# Altium schematic sheet Connectors.SchDoc: Extension connectors
size A3; DocumentNumber: MB1137; Revision: B-01; SheetNumber: 6; SheetTotal: 6; Project: NUCLEO-XXXXZX
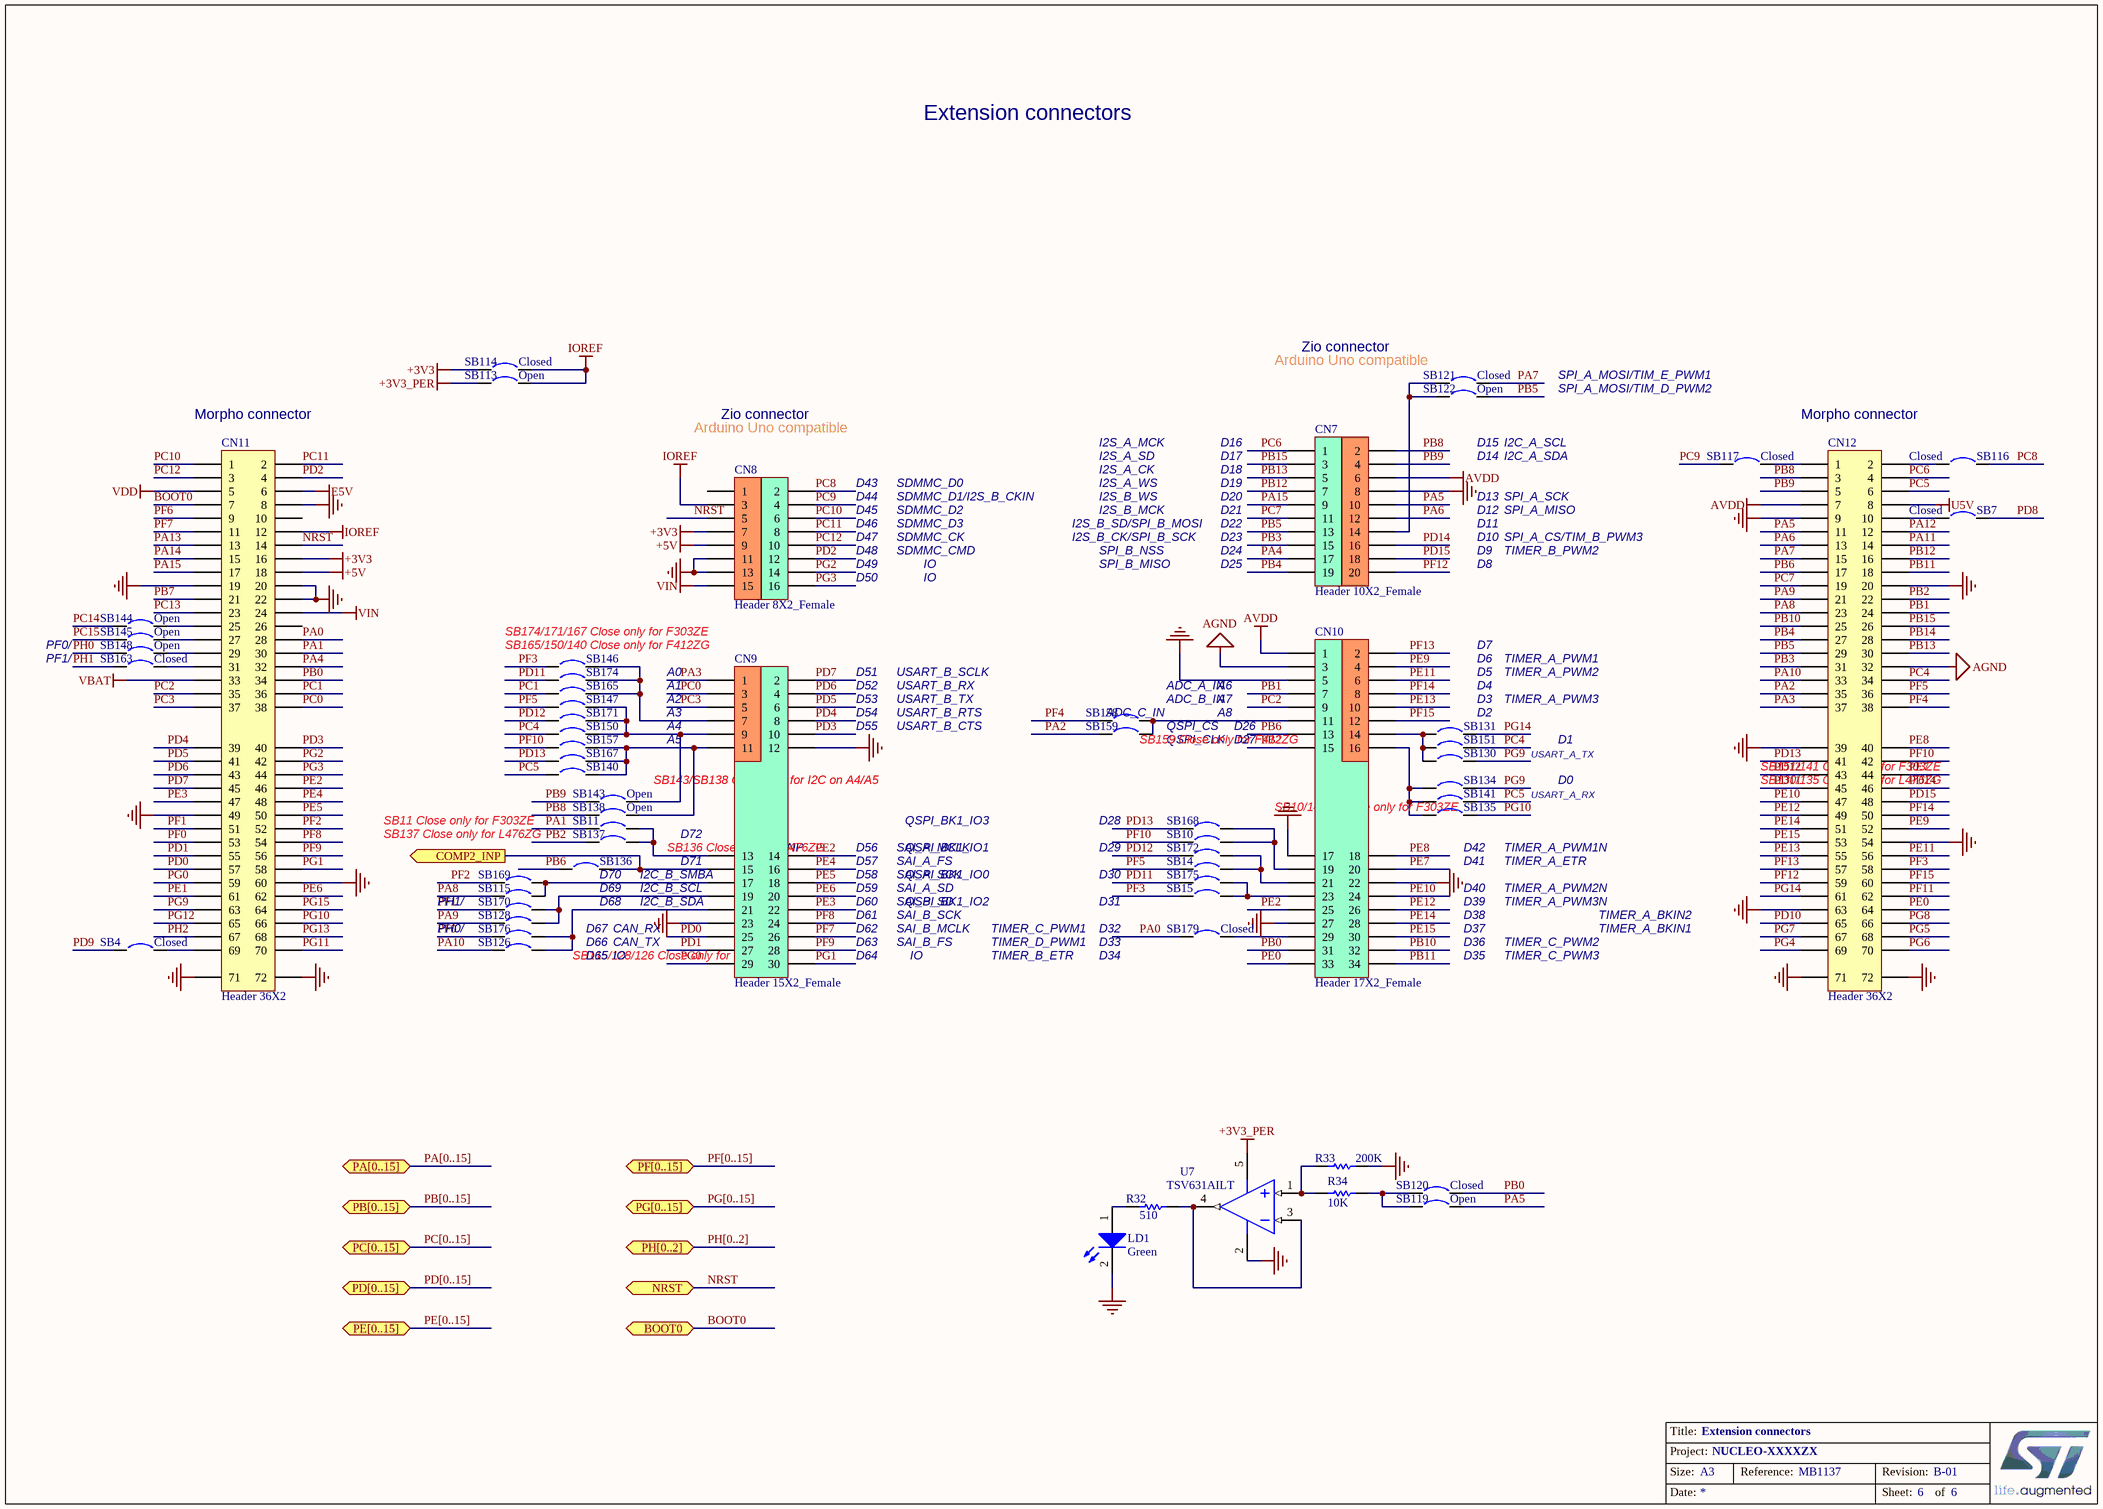
[diagram p0: Connectors.SchDoc]

## Parts
CN7  Header 10X2_Female  [HDR_10x2_2R54_V_F]
CN8  Header 8X2_Female  [HDR_8x2_2R54_V_F]
CN9  Header 15X2_Female  [HDR_15x2_2R54_V_F]
CN10  Header 17X2_Female  [HDR_17x2_2R54_V_F]
CN11  Header 36X2  [HDR_2x36_2R54_V_M]
CN12  Header 36X2  [HDR_2x36_2R54_V_M]
LD1  Green  [0603D-G]
R32  510  [0603R]
R33  200K  [0603R]
R34  10K  [0603R]
SB4  Closed  [SB_0603]
SB7  Closed  [SB_0603]
SB10  Circuit Breaker  [SB_0603]  (value not drawn)
SB11  Circuit Breaker  [SB_0603]  (value not drawn)
SB14  Circuit Breaker  [SB_0603]  (value not drawn)
SB15  Circuit Breaker  [SB_0603]  (value not drawn)
SB113  Open  [SB_0603]
SB114  Closed  [SB_0603]
SB115  Circuit Breaker  [SB_0603]  (value not drawn)
SB116  Closed  [SB_0603]
SB117  Closed  [SB_0603]
SB119  Open  [SB_0603]
SB120  Closed  [SB_0603]
SB121  Closed  [SB_0603]
SB122  Open  [SB_0603]
SB126  Circuit Breaker  [SB_0603]  (value not drawn)
SB128  Circuit Breaker  [SB_0603]  (value not drawn)
SB130  Circuit Breaker  [SB_0603]  (value not drawn)
SB131  Circuit Breaker  [SB_0603]  (value not drawn)
SB134  Circuit Breaker  [SB_0603]  (value not drawn)
SB135  Circuit Breaker  [SB_0603]  (value not drawn)
SB136  Circuit Breaker  [SB_0603]  (value not drawn)
SB137  Circuit Breaker  [SB_0603]  (value not drawn)
SB138  Open  [SB_0603]
SB140  Circuit Breaker  [SB_0603]  (value not drawn)
SB141  Circuit Breaker  [SB_0603]  (value not drawn)
SB143  Open  [SB_0603]
SB144  Open  [SB_0603]
SB145  Open  [SB_0603]
SB146  Circuit Breaker  [SB_0603]  (value not drawn)
SB147  Circuit Breaker  [SB_0603]  (value not drawn)
SB148  Open  [SB_0603]
SB150  Circuit Breaker  [SB_0603]  (value not drawn)
SB151  Circuit Breaker  [SB_0603]  (value not drawn)
SB157  Circuit Breaker  [SB_0603]  (value not drawn)
SB158  Circuit Breaker  [SB_0603]  (value not drawn)
SB159  Circuit Breaker  [SB_0603]  (value not drawn)
SB163  Closed  [SB_0603]
SB165  Circuit Breaker  [SB_0603]  (value not drawn)
SB167  Circuit Breaker  [SB_0603]  (value not drawn)
SB168  Circuit Breaker  [SB_0603]  (value not drawn)
SB169  Circuit Breaker  [SB_0603]  (value not drawn)
SB170  Circuit Breaker  [SB_0603]  (value not drawn)
SB171  Circuit Breaker  [SB_0603]  (value not drawn)
SB172  Circuit Breaker  [SB_0603]  (value not drawn)
SB174  Circuit Breaker  [SB_0603]  (value not drawn)
SB175  Circuit Breaker  [SB_0603]  (value not drawn)
SB176  Circuit Breaker  [SB_0603]  (value not drawn)
SB179  Closed  [SB_0603]
U7  TSV631AILT  [SOT-23-5L]

## Ports
BOOT0, COMP2_INP (out), NRST, PA[0..15] (bidir), PB[0..15] (bidir), PC[0..15] (bidir), PD[0..15] (bidir), PE[0..15] (bidir), PF[0..15] (bidir), PG[0..15] (bidir), PH[0..2] (bidir)

## Nets
+3V3: CN8.7 CN11.16 SB114.1
+3V3_PER: SB113.1 U7.5(VCC)
+5V: CN8.9 CN11.18
AGND: CN10.3 CN12.32
AVDD: CN7.6 CN10.1 CN12.7
E5V: CN11.6
GND: CN7.8 CN8.11 CN8.13 CN9.12 CN9.23 CN10.5 CN10.17 CN10.22 CN10.27 CN11.8 CN11.19 CN11.20 CN11.22 CN11.49 CN11.60 CN11.71 CN11.72 CN12.9 CN12.20 CN12.39 CN12.54 CN12.63 CN12.71 CN12.72 LD1.2(K) R33.2 U7.2(VDD)
IOREF: CN8.3 CN11.12 SB113.2 SB114.2
U5V: CN12.8
VBAT: CN11.33
VDD: CN11.5
VIN: CN8.15 CN11.24
BOOT0: CN11.7 ; port BOOT0
COMP2_INP: CN9.15 SB136.1 ; port COMP2_INP
NRST: CN8.5 CN11.14 ; port NRST
PA0: CN11.28 SB179.1
PA1: CN11.30 SB11.2
PA2: CN12.35 SB159.1
PA3: CN9.1 CN12.37
PA4: CN7.17 CN11.32
PA5: CN7.10 CN12.11 SB119.2
PA6: CN7.12 CN12.13
PA7: CN12.15 SB121.2
PA8: CN12.23 SB115.2
PA9: CN12.21 SB128.2
PA10: CN12.33 SB126.2
PA11: CN12.14
PA12: CN12.12
PA13: CN11.13
PA14: CN11.15
PA15: CN7.9 CN11.17
PB0: CN10.31 CN11.34 SB120.1
PB1: CN10.7 CN12.24
PB2: CN10.15 CN12.22 SB137.2
PB3: CN7.15 CN12.31
PB4: CN7.19 CN12.27
PB5: CN7.13 CN12.29 SB122.2
PB6: CN10.13 CN12.17 SB136.2
PB7: CN11.21
PB8: CN7.2 CN12.3 SB138.2
PB9: CN7.4 CN12.5 SB143.2
PB10: CN10.32 CN12.25
PB11: CN10.34 CN12.18
PB12: CN7.7 CN12.16
PB13: CN7.5 CN12.30
PB14: CN12.28
PB15: CN7.3 CN12.26
PC0: CN9.3 CN11.38
PC1: CN11.36 SB165.2
PC2: CN10.9 CN11.35
PC3: CN9.5 CN11.37
PC4: CN12.34 SB150.2 SB151.1
PC5: CN12.6 SB140.2 SB141.1
PC6: CN7.1 CN12.4
PC7: CN7.11 CN12.19
PC8: CN8.2 SB116.1
PC9: CN8.4 SB117.1
PC10: CN8.6 CN11.1
PC11: CN8.8 CN11.2
PC12: CN8.10 CN11.3
PC13: CN11.23
PC14: SB144.1
PC15: SB145.1
PD0: CN9.25 CN11.57
PD1: CN9.27 CN11.55
PD2: CN8.12 CN11.4
PD3: CN9.10 CN11.40
PD4: CN9.8 CN11.39
PD5: CN9.6 CN11.41
PD6: CN9.4 CN11.43
PD7: CN9.2 CN11.45
PD8: SB7.2
PD9: SB4.1
PD10: CN12.65
PD11: CN12.45 SB174.2 SB175.1
PD12: CN12.43 SB171.2 SB172.1
PD13: CN12.41 SB167.2 SB168.1
PD14: CN7.16 CN12.46
PD15: CN7.18 CN12.48
PE0: CN10.33 CN12.64
PE1: CN11.61
PE2: CN9.14 CN10.25 CN11.46
PE3: CN9.22 CN11.47
PE4: CN9.16 CN11.48
PE5: CN9.18 CN11.50
PE6: CN9.20 CN11.62
PE7: CN10.20 CN12.44
PE8: CN10.18 CN12.40
PE9: CN10.4 CN12.52
PE10: CN10.24 CN12.47
PE11: CN10.6 CN12.56
PE12: CN10.26 CN12.49
PE13: CN10.10 CN12.55
PE14: CN10.28 CN12.51
PE15: CN10.30 CN12.53
PF0: CN11.53 SB176.2
PF1: CN11.51 SB170.2
PF2: CN11.52 SB169.2
PF3: CN12.58 SB15.1 SB146.2
PF4: CN12.38 SB158.1
PF5: CN12.36 SB14.1 SB147.2
PF6: CN11.9
PF7: CN9.26 CN11.11
PF8: CN9.24 CN11.54
PF9: CN9.28 CN11.56
PF10: CN12.42 SB10.1 SB157.2
PF11: CN12.62
PF12: CN7.20 CN12.59
PF13: CN10.2 CN12.57
PF14: CN10.8 CN12.50
PF15: CN10.12 CN12.60
PG0: CN9.29 CN11.59
PG1: CN9.30 CN11.58
PG2: CN8.14 CN11.42
PG3: CN8.16 CN11.44
PG4: CN12.69
PG5: CN12.68
PG6: CN12.70
PG7: CN12.67
PG8: CN12.66
PG9: CN11.63 SB130.1 SB134.1
PG10: CN11.66 SB135.1
PG11: CN11.70
PG12: CN11.65
PG13: CN11.68
PG14: CN12.61 SB131.1
PG15: CN11.64
PH0: SB148.1
PH1: SB163.1
PH2: CN11.67
NetCN7_14: CN7.14 SB121.1 SB122.1
NetCN9_7: CN9.7 SB146.1 SB165.1 SB174.1
NetCN9_9: CN9.9 SB143.1 SB147.1 SB150.1 SB171.1
NetCN9_11: CN9.11 SB138.1 SB140.1 SB157.1 SB167.1
NetCN9_13: CN9.13 SB11.1 SB137.1
NetCN9_17: CN9.17 SB115.1 SB169.1
NetCN9_19: CN9.19 SB128.1 SB170.1
NetCN9_21: CN9.21 SB126.1 SB176.1
NetCN10_11: CN10.11 SB158.2 SB159.2
NetCN10_14: CN10.14 SB130.2 SB131.2 SB151.2
NetCN10_16: CN10.16 SB134.2 SB135.2 SB141.2
NetCN10_19: CN10.19 SB10.2 SB168.2
NetCN10_21: CN10.21 SB14.2 SB172.2
NetCN10_23: CN10.23 SB15.2 SB175.2
NetCN10_29: CN10.29 SB179.2
NetCN11_25: CN11.25 SB144.2
NetCN11_27: CN11.27 SB145.2
NetCN11_29: CN11.29 SB148.2
NetCN11_31: CN11.31 SB163.2
NetCN11_69: CN11.69 SB4.2
NetCN12_1: CN12.1 SB117.2
NetCN12_2: CN12.2 SB116.2
NetCN12_10: CN12.10 SB7.1
NetLD1_1: LD1.1(A) R32.2
NetR32_1: R32.1 U7.3(IN-) U7.4(OUT)
NetR33_1: R33.1 R34.1 U7.1(IN+)
NetR34_2: R34.2 SB119.1 SB120.2

Not connected (* = marked no-connect by the designer): CN8 1; CN11 10 26

## Buses and harness runs
bus PA[0..15] = port PA[0..15]
bus PB[0..15] = port PB[0..15]
bus PC[0..15] = port PC[0..15]
bus PD[0..15] = port PD[0..15]
bus PE[0..15] = port PE[0..15]
bus PF[0..15] = port PF[0..15]
bus PG[0..15] = port PG[0..15]
bus PH[0..2] = port PH[0..2]

## Notes on the sheet
- Extension connectors
- Arduino Uno compatible
- Zio connector
- SPI_A_MOSI/TIM_E_PWM1
- (near CN11) Morpho connector
- I2S_A_MCK
- D16
- D15
- I2C_A_SCL
- SPI_A_MOSI/TIM_D_PWM2
- Morpho connector
- D43
- D44
- D45
- SDMMC_D0
- SDMMC_D1/I2S_B_CKIN
- SDMMC_D2
- I2S_A_SD
- I2S_A_CK
- I2S_A_WS
- I2S_B_WS
- I2S_B_MCK
- D17
- D18
- D19
- D20
- D21
- D14
- D13
- D12
- SPI_A_SCK
- SPI_A_MISO
- I2C_A_SDA
- D46
- D47
- D48
- D49
- D50
- SDMMC_CK
- SDMMC_CMD
- SDMMC_D3
- IO
- I2S_B_SD/SPI_B_MOSI
- I2S_B_CK/SPI_B_SCK
- SPI_B_MISO
- SPI_B_NSS
- D22
- D23
- D24
- D25
- D8
- D9
- D10
- D11
- TIMER_B_PWM2
- SPI_A_CS/TIM_B_PWM3
- PF0/
- SB174/171/167 Close only for F303ZE
- (near SB146) SB165/150/140 Close only for F412ZG
- D7
- PF1/
- A0
- A1
- A2
- A3
- D51
- D52
- D53
- D54
- USART_B_TX
- USART_B_RX
- USART_B_SCLK
- USART_B_RTS
- ADC_A_IN
- ADC_B_IN
- ADC_C_IN
- A6
- A7
- A8
- (near SB131) D2
- D4
- D3
- D5
- D6
- TIMER_A_PWM1
- TIMER_A_PWM2
- TIMER_A_PWM3
- (near SB140) SB143/SB138 Close only for I2C on A4/A5
- A4
- A5
- D55
- USART_B_CTS
- (near SB159) SB159 Close only for F412ZG
- QSPI_CLK
- QSPI_CS
- D26
- D27
- USART_A_TX
- D0
- D1
- SB151/141 Close only for F303ZE
- SB130/135 Close only for L476ZG
- (near CN11) /PH1
- (near CN11) /PH0
- SB11 Close only for F303ZE
- SB137 Close only for L476ZG
- (near SB137) SB136 Close only for L476ZG
- D72
- (near CN9) COMP1_INP
- D56
- SAI_A_MCLK
- QSPI_BK1_IO1
- QSPI_BK1_IO3
- D28
- D29
- (near SB168) SB10/14/15 Close only for F303ZE
- D42
- TIMER_A_PWM1N
- USART_A_RX
- PH1/
- (near SB136) D70
- (near SB136) D69
- (near SB136) D68
- I2C_B_SCL
- I2C_B_SDA
- I2C_B_SMBA
- D71
- D57
- D58
- D59
- D60
- D61
- SAI_A_SD
- SAI_A_SCK
- SAI_A_FS
- SAI_B_SD
- SAI_B_SCK
- QSPI_BK1_IO0
- QSPI_BK1_IO2
- D30
- D31
- D38
- D39
- D40
- D41
- TIMER_A_PWM2N
- TIMER_A_PWM3N
- TIMER_A_ETR
- TIMER_A_BKIN2
- PH0/
- (near SB126) SB115/128/126 Close only for F303ZE
- D67
- D66
- D65
- CAN_TX
- CAN_RX
- D62
- D63
- D64
- SAI_B_FS
- SAI_B_MCLK
- TIMER_D_PWM1
- TIMER_B_ETR
- TIMER_C_PWM1
- D32
- D33
- D34
- D35
- D36
- D37
- TIMER_C_PWM2
- TIMER_C_PWM3
- TIMER_A_BKIN1
- Title:
- Project:
- Size:
- Date:
- Reference:
- Sheet:
- Revision:
- of

## Library data of the parts
CN7 = Header 10X2_Female: Header, 10-Pin, Dual row,female; LatestRevisionDate: 17-Jul-2002; LatestRevisionNote: Re-released for DXP Platform.; Publisher: Altium Limited
CN8 = Header 8X2_Female: Header, 8-Pin, Dual row,female; LatestRevisionDate: 17-Jul-2002; LatestRevisionNote: Re-released for DXP Platform.; Publisher: Altium Limited
CN9 = Header 15X2_Female: Header, 15-Pin, Dual row,female; Revision: 17-Jul-2002: Re-released for DXP Platform.; Publisher: Altium Limited
CN10 = Header 17X2_Female: Header, 17-Pin, Dual row,female; Revision: 17-Jul-2002: Re-released for DXP Platform.; Publisher: Altium Limited
CN11 CN12 = Header 36X2: Header, 36-Pin, Dual row; Revision: 17-Jul-2002: Re-released for DXP Platform.; Publisher: Altium Limited
LD1 = LED2: Typical RED, GREEN, YELLOW, AMBER GaAs LED; Published: 8-Jun-2000; Revision: July-2002: Re-released for DXP Platform.; Publisher: Altium Limited
R32 = Res1: Resistor; Value: 1K; Published: 8-Jun-2000; Revision: July-2002: Re-released for DXP Platform.; Publisher: Altium Limited
R33 R34 = res1: Resistor; Value: 1K; Published: 8-Jun-2000; Revision: July-2002: Re-released for DXP Platform.; Publisher: Altium Limited
SB4 SB7 SB114 SB116 SB117 SB120 SB121 SB163 SB179 = Circuit Breaker_close: Circuit Breaker; Published: 24-Mar-1999; Revision: July-2002: Re-released for DXP Platform.; Publisher: Altium Limited
SB10 SB11 SB14 SB15 SB115 SB126 SB128 SB130 SB131 SB134-SB137 SB140 SB141 SB146 SB147 SB150 SB151 SB157-SB159 SB165 SB167-SB172 SB174-SB176 = Circuit Breaker: Solder: NO; Published: 24-Mar-1999; Revision: July-2002: Re-released for DXP Platform.; Publisher: Altium Limited
SB113 SB119 SB122 SB138 SB143-SB145 SB148 = Circuit Breaker: Published: 24-Mar-1999; Revision: July-2002: Re-released for DXP Platform.; Publisher: Altium Limited